# Altium schematic sheet MC21R01_EtherCAT.SchDoc: MC21R01 Top Level
size A3; Author: AMP; DrawnBy: AMP; Organization: Altium Limited; Address1: 3 Minna Close; Address2: Belrose; Address3: NSW 2085; Address4: Australia; DocumentNumber: 0; Revision: 1.0; SheetNumber: 0; SheetTotal: 0
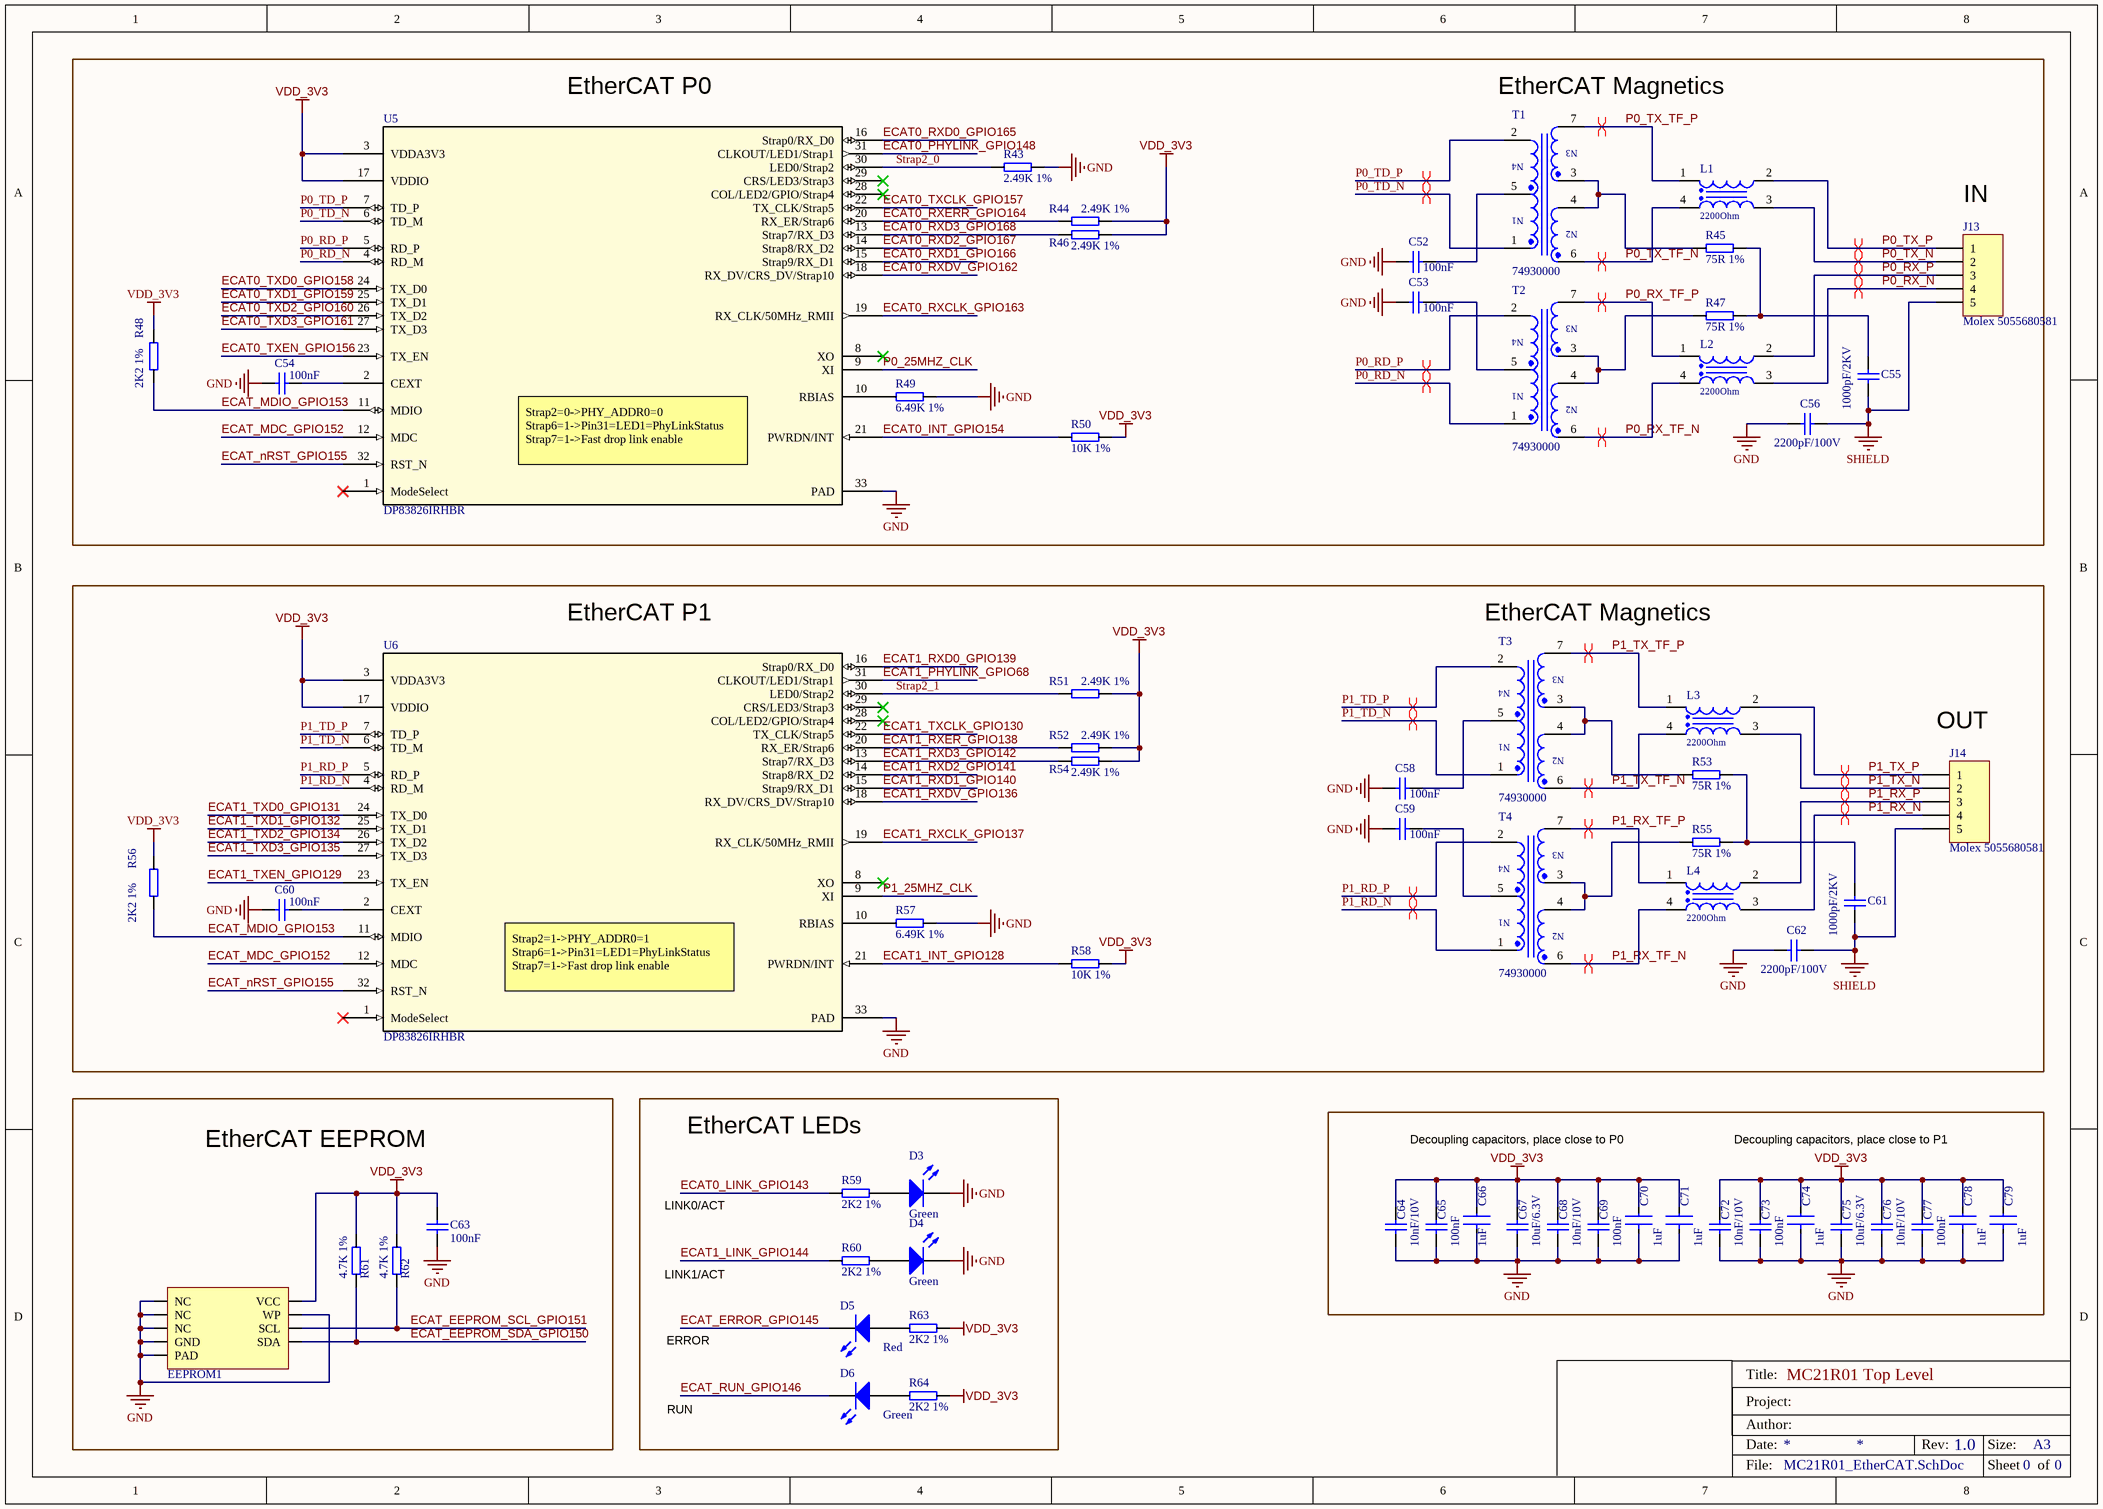
[diagram p0: MC21R01_EtherCAT.SchDoc]

## Parts
C52  value 100nF  [CAPC0603X03N]  (hidden comment: 100nF/25V 0201 10% X6S)
C53  value 100nF  [CAPC0603X03N]  (hidden comment: 100nF/25V 0201 10% X6S)
C54  value 100nF  [CAPC0603X03N]  (hidden comment: 100nF/25V 0201 10% X6S)
C55  1000pF/2KV  [1206 SMD Capacitor]
C56  value 2200pF/100V  [0402 SMD Capacitor]  (hidden comment: 2200pF/100V 0402 10% X7S)
C58  value 100nF  [CAPC0603X03N]  (hidden comment: 100nF/25V 0201 10% X6S)
C59  value 100nF  [CAPC0603X03N]  (hidden comment: 100nF/25V 0201 10% X6S)
C60  value 100nF  [CAPC0603X03N]  (hidden comment: 100nF/25V 0201 10% X6S)
C61  1000pF/2KV  [1206 SMD Capacitor]
C62  value 2200pF/100V  [0402 SMD Capacitor]  (hidden comment: 2200pF/100V 0402 10% X7S)
C63  value 100nF  [CAPC0603X03N]  (hidden comment: 100nF/25V 0201 10% X6S)
C64  value 10nF/10V  [0402 SMD Capacitor]  (hidden comment: 10nF/10V 0402 20% X5R)
C65  value 100nF  [CAPC0603X03N]  (hidden comment: 100nF/25V 0201 10% X6S)
C66  Capacitance: 1uF  [FP-CL03-IPC_A]  (hidden comment: 1uF/6.3V 0201 10% X5R)
C67  value 10uF/6.3V  [0402 SMD Capacitor]  (hidden comment: 10uF/6.3V 0402 20% X5R)
C68  value 10nF/10V  [0402 SMD Capacitor]  (hidden comment: 10nF/10V 0402 20% X5R)
C69  value 100nF  [CAPC0603X03N]  (hidden comment: 100nF/25V 0201 10% X6S)
C70  Capacitance: 1uF  [FP-CL03-IPC_A]  (hidden comment: 1uF/6.3V 0201 10% X5R)
C71  Capacitance: 1uF  [FP-CL03-IPC_A]  (hidden comment: 1uF/6.3V 0201 10% X5R)
C72  value 10nF/10V  [0402 SMD Capacitor]  (hidden comment: 10nF/10V 0402 20% X5R)
C73  value 100nF  [CAPC0603X03N]  (hidden comment: 100nF/25V 0201 10% X6S)
C74  Capacitance: 1uF  [FP-CL03-IPC_A]  (hidden comment: 1uF/6.3V 0201 10% X5R)
C75  value 10uF/6.3V  [0402 SMD Capacitor]  (hidden comment: 10uF/6.3V 0402 20% X5R)
C76  value 10nF/10V  [0402 SMD Capacitor]  (hidden comment: 10nF/10V 0402 20% X5R)
C77  value 100nF  [CAPC0603X03N]  (hidden comment: 100nF/25V 0201 10% X6S)
C78  Capacitance: 1uF  [FP-CL03-IPC_A]  (hidden comment: 1uF/6.3V 0201 10% X5R)
C79  Capacitance: 1uF  [FP-CL03-IPC_A]  (hidden comment: 1uF/6.3V 0201 10% X5R)
D3  Green  [0402 SMD LED GREEN]
D4  Green  [0402 SMD LED GREEN]
D5  Red  [0402 SMD LED Red]
D6  Green  [0402 SMD LED GREEN]
EEPROM1  CAT24C16HU4I-GT3  [PQFN50P300X200X50_HS-9N]  (value not drawn)
J13  Molex 5055680581  [Molex 5055680581]
J14  Molex 5055680581  [Molex 5055680581]
L1  2200Ohm  [744232222]
L2  2200Ohm  [744232222]
L3  2200Ohm  [744232222]
L4  2200Ohm  [744232222]
R43  2.49K 1%  [0402 SMD rESISTOR]
R44  2.49K 1%  [0402 SMD rESISTOR]
R45  75R 1%  [0402 SMD rESISTOR]
R46  2.49K 1%  [0402 SMD rESISTOR]
R47  75R 1%  [0402 SMD rESISTOR]
R48  2K2 1%  [0402 SMD rESISTOR]
R49  6.49K 1%  [0402 SMD rESISTOR]
R50  10K 1%  [0402 SMD rESISTOR]
R51  2.49K 1%  [0402 SMD rESISTOR]
R52  2.49K 1%  [0402 SMD rESISTOR]
R53  75R 1%  [0402 SMD rESISTOR]
R54  2.49K 1%  [0402 SMD rESISTOR]
R55  75R 1%  [0402 SMD rESISTOR]
R56  2K2 1%  [0402 SMD rESISTOR]
R57  6.49K 1%  [0402 SMD rESISTOR]
R58  10K 1%  [0402 SMD rESISTOR]
R59  2K2 1%  [0402 SMD rESISTOR]
R60  2K2 1%  [0402 SMD rESISTOR]
R61  4.7K 1%  [0402 SMD rESISTOR]
R62  4.7K 1%  [0402 SMD rESISTOR]
R63  2K2 1%  [0402 SMD rESISTOR]
R64  2K2 1%  [0402 SMD rESISTOR]
T1  74930000  [74930000]
T2  74930000  [74930000]
T3  74930000  [74930000]
T4  74930000  [74930000]
U5  DP83826IRHBR  [RHB0032B]
U6  DP83826IRHBR  [RHB0032B]

## Blocks framed on the sheet
EtherCAT EEPROM: C63 EEPROM1 R61 R62
EtherCAT LEDs: D3-D6 R59 R60 R63 R64

## Nets
GND: C52.2 C53.2 C54.1 C56.1 C58.2 C59.2 C60.1 C62.1 C63.1 C64.2 C65.1 C66.1 C67.2 C68.2 C69.1 C70.1 C71.1 C72.2 C73.1 C74.1 C75.2 C76.2 C77.1 C78.1 C79.1 D3.K D4.K EEPROM1.1(NC) EEPROM1.2(NC) EEPROM1.3(NC) EEPROM1.4(GND) EEPROM1.7(WP) EEPROM1.9(PAD) R43.1 R49.2 R57.2 U5.33(PAD) U6.33(PAD)
SHIELD: C55.2 C56.2 C61.2 C62.2 J13.5 J14.5
VDD_3V3: C63.2 C64.1 C65.2 C66.2 C67.1 C68.1 C69.2 C70.2 C71.2 C72.1 C73.2 C74.2 C75.1 C76.1 C77.2 C78.2 C79.2 EEPROM1.8(VCC) R44.1 R46.2 R48.2 R50.1 R51.1 R52.1 R54.2 R56.2 R58.1 R61.2 R62.2 R63.1 R64.1 U5.3(VDDA3V3) U5.17(VDDIO) U6.3(VDDA3V3) U6.17(VDDIO)
ECAT0_INT_GPIO154: R50.2 U5.21(PWRDN/INT)
ECAT0_LINK_GPIO143: R59.2
ECAT0_PHYLINK_GPIO148: U5.31(CLKOUT/LED1/Strap1)
ECAT0_RXCLK_GPIO163: U5.19(RX_CLK/50MHz_RMII)
ECAT0_RXD0_GPIO165: U5.16(Strap0/RX_D0)
ECAT0_RXD1_GPIO166: U5.15(Strap9/RX_D1)
ECAT0_RXD2_GPIO167: U5.14(Strap8/RX_D2)
ECAT0_RXD3_GPIO168: R46.1 U5.13(Strap7/RX_D3)
ECAT0_RXDV_GPIO162: U5.18(RX_DV/CRS_DV/Strap10)
ECAT0_RXERR_GPIO164: R44.2 U5.20(RX_ER/Strap6)
ECAT0_TXCLK_GPIO157: U5.22(TX_CLK/Strap5)
ECAT0_TXD0_GPIO158: U5.24(TX_D0)
ECAT0_TXD1_GPIO159: U5.25(TX_D1)
ECAT0_TXD2_GPIO160: U5.26(TX_D2)
ECAT0_TXD3_GPIO161: U5.27(TX_D3)
ECAT0_TXEN_GPIO156: U5.23(TX_EN)
ECAT1_INT_GPIO128: R58.2 U6.21(PWRDN/INT)
ECAT1_LINK_GPIO144: R60.2
ECAT1_PHYLINK_GPIO68: U6.31(CLKOUT/LED1/Strap1)
ECAT1_RXCLK_GPIO137: U6.19(RX_CLK/50MHz_RMII)
ECAT1_RXD0_GPIO139: U6.16(Strap0/RX_D0)
ECAT1_RXD1_GPIO140: U6.15(Strap9/RX_D1)
ECAT1_RXD2_GPIO141: U6.14(Strap8/RX_D2)
ECAT1_RXD3_GPIO142: R54.1 U6.13(Strap7/RX_D3)
ECAT1_RXDV_GPIO136: U6.18(RX_DV/CRS_DV/Strap10)
ECAT1_RXER_GPIO138: R52.2 U6.20(RX_ER/Strap6)
ECAT1_TXCLK_GPIO130: U6.22(TX_CLK/Strap5)
ECAT1_TXD0_GPIO131: U6.24(TX_D0)
ECAT1_TXD1_GPIO132: U6.25(TX_D1)
ECAT1_TXD2_GPIO134: U6.26(TX_D2)
ECAT1_TXD3_GPIO135: U6.27(TX_D3)
ECAT1_TXEN_GPIO129: U6.23(TX_EN)
ECAT_EEPROM_SCL_GPIO151: EEPROM1.6(SCL) R62.1
ECAT_EEPROM_SDA_GPIO150: EEPROM1.5(SDA) R61.1
ECAT_ERROR_GPIO145: D5.K
ECAT_MDC_GPIO152: U5.12(MDC) U6.12(MDC)
ECAT_MDIO_GPIO153: R48.1 R56.1 U5.11(MDIO) U6.11(MDIO)
ECAT_nRST_GPIO155: U5.32(RST_N) U6.32(RST_N)
ECAT_RUN_GPIO146: D6.K
P0_25MHZ_CLK: U5.9(XI)
P0_RD_N: T2.1 U5.4(RD_M)
P0_RD_P: T2.2 U5.5(RD_P)
P0_RX_N: J13.4 L2.3
P0_RX_P: J13.3 L2.2
P0_RX_TF_N: L2.4 T2.6
P0_RX_TF_P: L2.1 T2.7
P0_TD_N: T1.1 U5.6(TD_M)
P0_TD_P: T1.2 U5.7(TD_P)
P0_TX_N: J13.2 L1.3
P0_TX_P: J13.1 L1.2
P0_TX_TF_N: L1.4 T1.6
P0_TX_TF_P: L1.1 T1.7
P1_25MHZ_CLK: U6.9(XI)
P1_RD_N: T4.1 U6.4(RD_M)
P1_RD_P: T4.2 U6.5(RD_P)
P1_RX_N: J14.4 L4.3
P1_RX_P: J14.3 L4.2
P1_RX_TF_N: L4.4 T4.6
P1_RX_TF_P: L4.1 T4.7
P1_TD_N: T3.1 U6.6(TD_M)
P1_TD_P: T3.2 U6.7(TD_P)
P1_TX_N: J14.2 L3.3
P1_TX_P: J14.1 L3.2
P1_TX_TF_N: L3.4 T3.6
P1_TX_TF_P: L3.1 T3.7
Strap2_0: R43.2 U5.30(LED0/Strap2)
Strap2_1: R51.2 U6.30(LED0/Strap2)
NetC52_1: C52.1 T1.5
NetC53_1: C53.1 T2.5
NetC54_2: C54.2 U5.2(CEXT)
NetC55_1: C55.1 R45.1 R47.1
NetC58_1: C58.1 T3.5
NetC59_1: C59.1 T4.5
NetC60_2: C60.2 U6.2(CEXT)
NetC61_1: C61.1 R53.1 R55.1
NetD3_A: D3.A R59.1
NetD4_A: D4.A R60.1
NetD5_A: D5.A R63.2
NetD6_A: D6.A R64.2
NetR45_2: R45.2 T1.3 T1.4
NetR47_2: R47.2 T2.3 T2.4
NetR49_1: R49.1 U5.10(RBIAS)
NetR53_2: R53.2 T3.3 T3.4
NetR55_2: R55.2 T4.3 T4.4
NetR57_1: R57.1 U6.10(RBIAS)

Not connected (* = marked no-connect by the designer): U5 1(ModeSelect)* 8(XO)* 28(COL/LED2/GPIO/Strap4)* 29(CRS/LED3/Strap3)*; U6 1(ModeSelect)* 8(XO)* 28(COL/LED2/GPIO/Strap4)* 29(CRS/LED3/Strap3)*

## Layout directives
differential pair; differential pair class EtherCAT: P0_RD_N, P0_RD_P, P0_RX_N, P0_RX_P, P0_RX_TF_N, P0_RX_TF_P, P0_TD_N, P0_TX_N, P0_TX_P, P0_TX_TF_N, P0_TX_TF_P, P1_RD_N, P1_RD_P, P1_RX_N, P1_RX_P, P1_RX_TF_N, P1_RX_TF_P, P1_TD_N, P1_TD_P, P1_TX_N, P1_TX_P, P1_TX_TF_N, P1_TX_TF_P
differential pair; differential pair class EtherCAT; differential pair class EtherCAT: P0_TD_P

## Notes on the sheet
- (near U5) EtherCAT P0
- (near T1) EtherCAT Magnetics
- (near J13) IN
- (near U5) Strap2=0->PHY_ADDR0=0
  Strap6=1->Pin31=LED1=PhyLinkStatus
  Strap7=1->Fast drop link enable
- (near U6) EtherCAT P1
- (near T3) EtherCAT Magnetics
- (near J14) OUT
- (near U6) Strap2=1->PHY_ADDR0=1
  Strap6=1->Pin31=LED1=PhyLinkStatus
  Strap7=1->Fast drop link enable
- Decoupling capacitors, place close to P0
- Decoupling capacitors, place close to P1
- LINK0/ACT
- LINK1/ACT
- ERROR
- Title:
- RUN
- Date:
- Project:
- Author:
- Rev:
- Size:
- A3
- File:
- Sheet
- of
- (in symbol 74930000) N3; N4; N1; N2

## Library data of the parts
C52-C54 C58-C60 C63 C65 C69 C73 C77 = CMP-001-00061-1: 100nF/25V 0201 10% Tolerance X6S Multilayer Ceramic Chip Capacitor; Populated: Yes; Provided by customer: No; Voltage Rating (DC): 25V; Capacitance: 100nF; Case/Package: 0201; Case Code (Imperial): 0201; Case Code (Metric): 0603; Dielectric: X6S; Height: 0.3mm; Length: 0.024inch; Max Operating Temperature: 105°C; Min Operating Temperature: -55°C; Mount: Surface Mount; Package Quantity: 15000; Packaging: Tape and Reel; Termination: SMD/SMT; Thickness: 0.013inch; Tolerance: 10%; Voltage Rating: 25V; Weight: 1.2E-05oz; Width: 0.3mm
C55 C61 = 1000pF/2KV 1206 10% X7R: 1000 pF 2 KV 1206  ±10% Tolerance X7R Multilayer Ceramic Chip Capacitor; Manufacturer 1: Kemet; Manufacturer Part Number 1: C1206C102KGRACTU; Supplier Part Number 1: 1572651; Supplier 1: Farnell; Value: 1000pF/2KV
C56 C62 = 2200pF/100V 0402 10% X7S: 2200pF/100V 0402 10% Tolerance X7S Multilayer Ceramic Chip Capacitor; Manufacturer 1: TDK; Manufacturer Part Number 1: C1005X7S2A222K050BB; Supplier 1: Farnell; Supplier Part Number 1: 2906779
C64 C68 C72 C76 = 10nF/10V 0402 20% X5R: 10nF/10V 0402 20% Tolerance X5R Multilayer Ceramic Chip Capacitor; Manufacturer 1: KEMET; Manufacturer Part Number 1: C0402C103K8PACTU; Supplier Part Number 1: 2773069; Supplier 1: Farnell
C66 C70 C71 C74 C78 C79 = CMP-13271-003873-1: 1uF/6.3V 0201 10% Tolerance X5R Multilayer Ceramic Chip Capacitor; Voltage Rating: 6.3V; Tolerance: 20%; Lead Free: Lead Free; Packaging: Tape and Reel; Dielectric: X5R; Case Code (Imperial): 0201; Max Operating Temperature: 85°C; Case/Package: 0201; Depth: 0.3mm; Width: 0.012inch; Thickness: 0.013inch; Length: 0.024inch; Case Code (Metric): 0603; Package Quantity: 1; Min Operating Temperature: -55°C; Mount: Surface Mount
C67 C75 = 10uF/6.3V 0402 20% X5R: 10uF/6.3V 0402 20% Tolerance X5R Multilayer Ceramic Chip Capacitor; Manufacturer 1: KEMET; Manufacturer Part Number 1: C0402C106M9PACTU; Supplier Part Number 1: 2507061; Supplier 1: Farnell
D3 D4 D6 = LED_0402_green: Low Profile Chip LED, Green; Manufacturer: ROHM; Manufacturer Part Number: SML-P11MTT86R; Supplier 1: Farnell; Supplier Part Number 1: 2507544
D5 = LED_0402_Red: Low Profile Chip LED, Red; Manufacturer: ROHM; Manufacturer Part Number: SML-P11UTT86R; Supplier 1: Farnell; Supplier Part Number 1: 2507545
EEPROM1 = CAT24C16HU4I-GT3: CAT24C16 Series 16 Kb (2K x 8) 400 kHz I2C CMOS Serial EEPROM - UDFN-8EP; Manufacturer: ON Semi; Manufacturer Part Number: CAT24C16 Series 16 Kb (2K x 8) 400 kHz I2C CMOS Serial EEPROM - UDFN-8EP; Created By: AMP; Published: 20-08-2020; Supplier 1: Mouser; Supplier Part Number 1: 863-CAT24C16HU4I-GT3
J13 J14 = Molex 5055680581: 1.25mm Pitch, Micro-Lock Plus PCB Header, Single Row, Vertical, Surface Mount, Gold Plating, Positive Lock, 5 Circuits, Tape and Reel, Black; Mating Part Number: Molex 5055650501; Crimp: Molex 5054311100; Created by: AMP; Published: 29/05/2020; Manufacturer: Molex; Manufacturer Part Number: 5055680581; Supplier 1: Mouser; Supplier Part Number 1: 538-505568-0581
L1-L4 = 744232222: WE-CNSW SMT Common Mode Line Filter, size 1206, 2200Ohm, 0.2A, 50V; Manufacturer: Wurth Elektronik; DC Resistance max.: 1.2Ohm; Impedance Test Condition: 100MHz; Insulation Test Voltage: 125VAC; Winding Style: bifiliar; ComponentLink1Description: Manufacturer; ComponentLink1URL: http://www.we-online.de; ComponentLink2Description: Datasheet; ComponentLink2URL: https://www.we-online.com/catalog/datasheet/744232222.pdf; Operating Temperature: -40 to +125degC; Packaging: Tape and Reel; Published Date: April 2020; Rated Current: 0.2A; Size: 1206; Impedance: 2200Ohm; Manufacturer Part Number: 744232222; Rated Voltage: 50V; Mounting Technology: SMT; Supplier 1: Mouser; Supplier Part Number 1: 710-744232222
R43 R44 R46 R51 R52 R54 = 2.49K/50V 1% 0402 100mW: 2.49K/50V 1% 0402 100mW SMD Resistor; Manufacturer 1: Vishay; Manufacturer Part Number 1: CRCW04022K49FKED; Supplier 1: Farnell; Supplier Part Number 1: 1469690; Value: 2.49K
R45 R47 R53 R55 = 75R/50V 1% 0402 100mW: 75R/50V 1% 0402 100mW SMD Resistor; Manufacturer 1: Vishay; Manufacturer Part Number 1: RC0402FR-071KL; Supplier 1: Farnell; Supplier Part Number 1: 1469734; Value: 75R
R48 R56 R59 R60 R63 R64 = 2K2/50V 1% 0402 100mW: 2K2/50V 1% 0402 100mW SMD Resistor; Manufacturer 1: Yageo; Manufacturer Part Number 1: RC0402FR-072K2L; Value: 2.2k; Supplier 1: Farnell; Supplier Part Number 1: 9239278
R49 R57 = 6.49K/50V 1% 0402 100mW: 6.49K/50V 1% 0402 100mW SMD Resistor; Manufacturer 1: Vishay; Manufacturer Part Number 1: CRCW04026K49FKED; Supplier 1: Farnell; Supplier Part Number 1: 1469727; Value: 6.49K
R50 R58 = 10K/50V 1% 0402 100mW: 10K/50V 1% 0402 100mW SMD Resistor; Manufacturer 1: Yageo; Manufacturer Part Number 1: RC0402FR-0710KL; Supplier 1: Farnell; Supplier Part Number 1: 9239359; Value: 10K
R61 R62 = 4.7K/50V 1% 0402 100mW: 4.7K/50V 1% 0402 100mW SMD Resistor; Manufacturer 1: Vishay; Manufacturer Part Number 1: CRCW04024K70FKED; Supplier 1: Farnell; Supplier Part Number 1: 1469712; Value: 4.7K
T1-T4 = 74930000: WE-STST Super Tiny Signal Transformer, size 4532, 350uH; Insulation Test Voltage: 1500VRMS; Turns Ratio: 1:1; ComponentLink1Description: Manufacturer; ComponentLink1URL: http://www.we-online.de; ComponentLink2Description: Datasheet; ComponentLink2URL: https://katalog.we-online.com/pbs/datasheet/74930000.pdf; Packaging: Tape and Reel; Publisher: Wurth Elektronik; Size: 4532; Inductance: 350uH; Mounting Technology: SMT; Operating Temperature: -40 to +105degC; Part Number: 74930000; Published Date: November 2019
U5 U6 = DP83826IRHBR: Low latency 10/100-Mbps PHY, MII interface and enhanced mode with an industrial temperature range 32-VQFN -40 to 85; Manufacturer: Texas Instruments; Supplier 1: Avnet; Manufacturer Part Number: DP83826IRHBR; Pricing 1: 3000=1,00750, 6000=0,96850, 12000=0,92300, 18000=0,89700, 24000=0,86450 (USD); ComponentLink1URL: https://octopart.com/click/track?ai=8629&ct=datasheets&sig=00cfb32&at=physicalpart&sid=370&ppid=108112645&hlid=29178382&src-supplier=TI+store; ComponentLink1Description: https://octopart.com/click/track?ai=8629&ct=datasheets&sig=00cfb32&at=physicalpart&sid=370&ppid=108112645&hlid=29178382&src-supplier=TI+store; Supplier Part Number 1: DP83826IRHBR